# Altium schematic sheet Controles_Botones.SchDoc
size A4; SheetNumber: 21; SheetTotal: 21
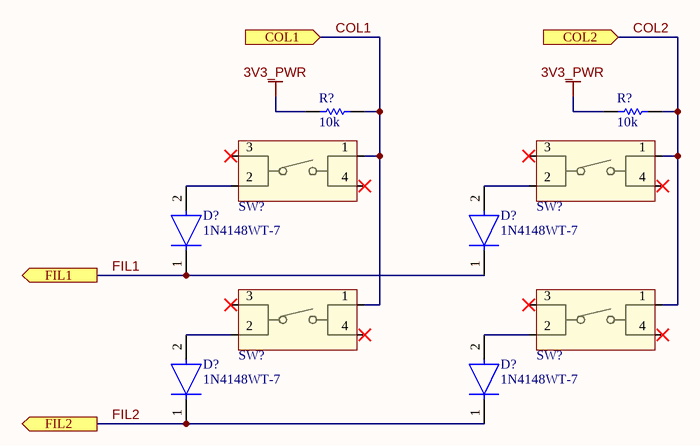
[diagram p0: Controles_Botones.SchDoc]

## Parts
(Parts that share a designator on the sheet are numbered #1, #2 ... from top to bottom, then left to right.)
D?#1  1N4148WT-7  [FP-SOD523-MFG]
D?#2  1N4148WT-7  [FP-SOD523-MFG]
D?#3  1N4148WT-7  [FP-SOD523-MFG]
D?#4  1N4148WT-7  [FP-SOD523-MFG]
R?#1  10k  [RESC1005X40X25ML05T05]
R?#2  10k  [RESC1005X40X25ML05T05]
SW?#1  KSC441G70SHLFSPF  [KSC441G 70SH LFS PF]  (value not drawn)
SW?#2  KSC441G70SHLFSPF  [KSC441G 70SH LFS PF]  (value not drawn)
SW?#3  KSC441G70SHLFSPF  [KSC441G 70SH LFS PF]  (value not drawn)
SW?#4  KSC441G70SHLFSPF  [KSC441G 70SH LFS PF]  (value not drawn)

## Ports
COL1 (in), COL2 (in), FIL1 (out), FIL2 (out)

## Nets
3V3_PWR: R?#1.2 R?#2.2
COL1: R?#1.1 SW?#1.1 SW?#3.1 ; port COL1
COL2: R?#2.1 SW?#2.1 SW?#4.1 ; port COL2
FIL1: D?#1.1(C) D?#2.1(C) ; port FIL1
FIL2: D?#3.1(C) D?#4.1(C) ; port FIL2
NetD?#1_2: D?#1.2(A) SW?#1.2
NetD?#2_2: D?#2.2(A) SW?#2.2
NetD?#3_2: D?#3.2(A) SW?#3.2
NetD?#4_2: D?#4.2(A) SW?#4.2

Not connected (* = marked no-connect by the designer): SW?#1 3(2)* 4(3)*; SW?#2 3(2)* 4(3)*; SW?#3 3(2)* 4(3)*; SW?#4 3(2)* 4(3)*

## Library data of the parts
D?#1-D?#4 = CMP-2000-05518-3: DIODE GEN PURP 80V 125MA SOD523; Power Rating: 150mW; Peak Non-Repetitive Surge Current: 2A; Forward Voltage: 1.25V; Reverse Recovery Time: 4ns; Peak Reverse Current: 1uA; Max Repetitive Reverse Voltage (Vrrm): 100V; Capacitance: 2pF; Polarity: Standard; Element Configuration: Single; Forward Current: 250mA; Lead Free: Lead Free; Packaging: Tape and Reel; Length: 0.9mm; Min Operating Temperature: -65°C; Current Rating: 125mA; Max Reverse Voltage (DC): 80V; Width: 1.3mm; Package Quantity: 3000; Output Current: 125mA; Power Dissipation: 150mW; Max Operating Temperature: 150°C; Radiation Hardening: No; Average Rectified Current: 125mA; Height: 0.65mm; Voltage Rating (DC): 80V; Max Surge Current: 2A; Weight: 3.5E-05oz; Recovery Time: 4ns; Max Forward Surge Current (Ifsm): 2A; Contact Plating: Tin; Number of Pins: 2; Mount: Surface Mount; REACH SVHC: No SVHC
R?#1 R?#2 = CMP-2002-00601-1: Manufacturer: Panasonic; Part Number: ERJ-2RHD1002X
SW?#1-SW?#4 = KSC441G70SHLFSPF: Switch Tactile N.O. SPST Button 1VA 32VDC 50mA 4N Gull Wing SMD T/R; Manufacturer: C&K Components; Supplier: DigiKey; Supplier Part Number: CKN11980CT-ND; Manufacturer Part Number: KSC441G70SHLFSPF; RoHS: Compliant; Category: Tactile Switches; Stock: 1; Pricing: 1=1.04, 10=0.887, 25=0.8248, 100=0.7353, 250=0.6812, 500=0.64368 (USD); Contact Current Rating: 50mA; Operating Force: 4N; ComponentLink1URL: https://datasheet.octopart.com:443/KSC441G70SHLFSPF-C%26K-Components-datasheet-128529453.pdf?src-supplier=Electro+Sonic; ComponentLink1Description: https://datasheet.octopart.com:443/KSC441G70SHLFSPF-C%26K-Components-datasheet-128529453.pdf?src-supplier=Electro+Sonic; ComponentLink2URL: https://datasheet.octopart.com:443/KSC441G70SHLFSPF-C%26K-Components-datasheet-100062959.pdf?src-supplier=Future+Electronics; ComponentLink2Description: https://datasheet.octopart.com:443/KSC441G70SHLFSPF-C%26K-Components-datasheet-100062959.pdf?src-supplier=Future+Electronics; Supplier 1: DigiKey; Supplier Part Number 1: CKN11980CT-ND